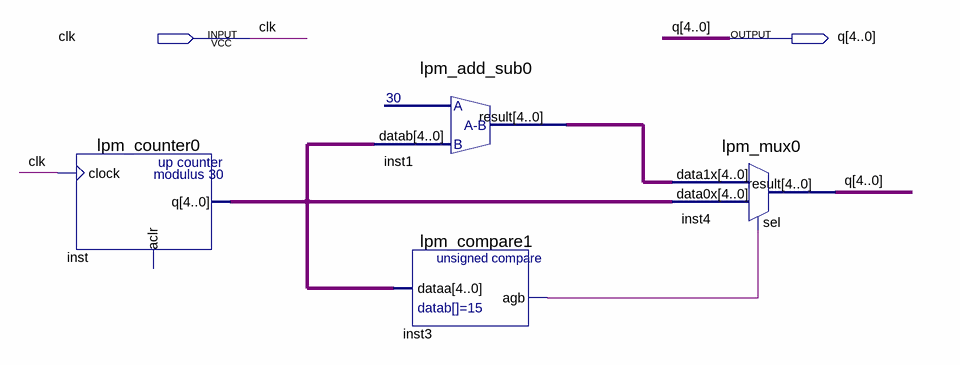
[diagram p0: schematic sheet]
// Quartus schematic lab.bdf as structural Verilog: 4 symbols, 2 pins
module lab (
  input  clk,
  output [4:0] q
);

  wire inst3_agb;
  wire [4:0] inst1_result, inst_q;

  lpm_counter0 inst (.clock(clk), .q(inst_q));  // open: aclr
  lpm_add_sub0 inst1 (.datab(inst_q), .result(inst1_result));
  lpm_compare1 inst3 (.dataa(inst_q), .agb(inst3_agb));
  lpm_mux0 inst4 (.data1x(inst1_result), .data0x(inst_q), .sel(inst3_agb), .result(q));
endmodule
